# Altium schematic sheet ENET.SchDoc: Ethernet
size A3; Author: Vi Tín; SheetNumber: 12; SheetTotal: 15
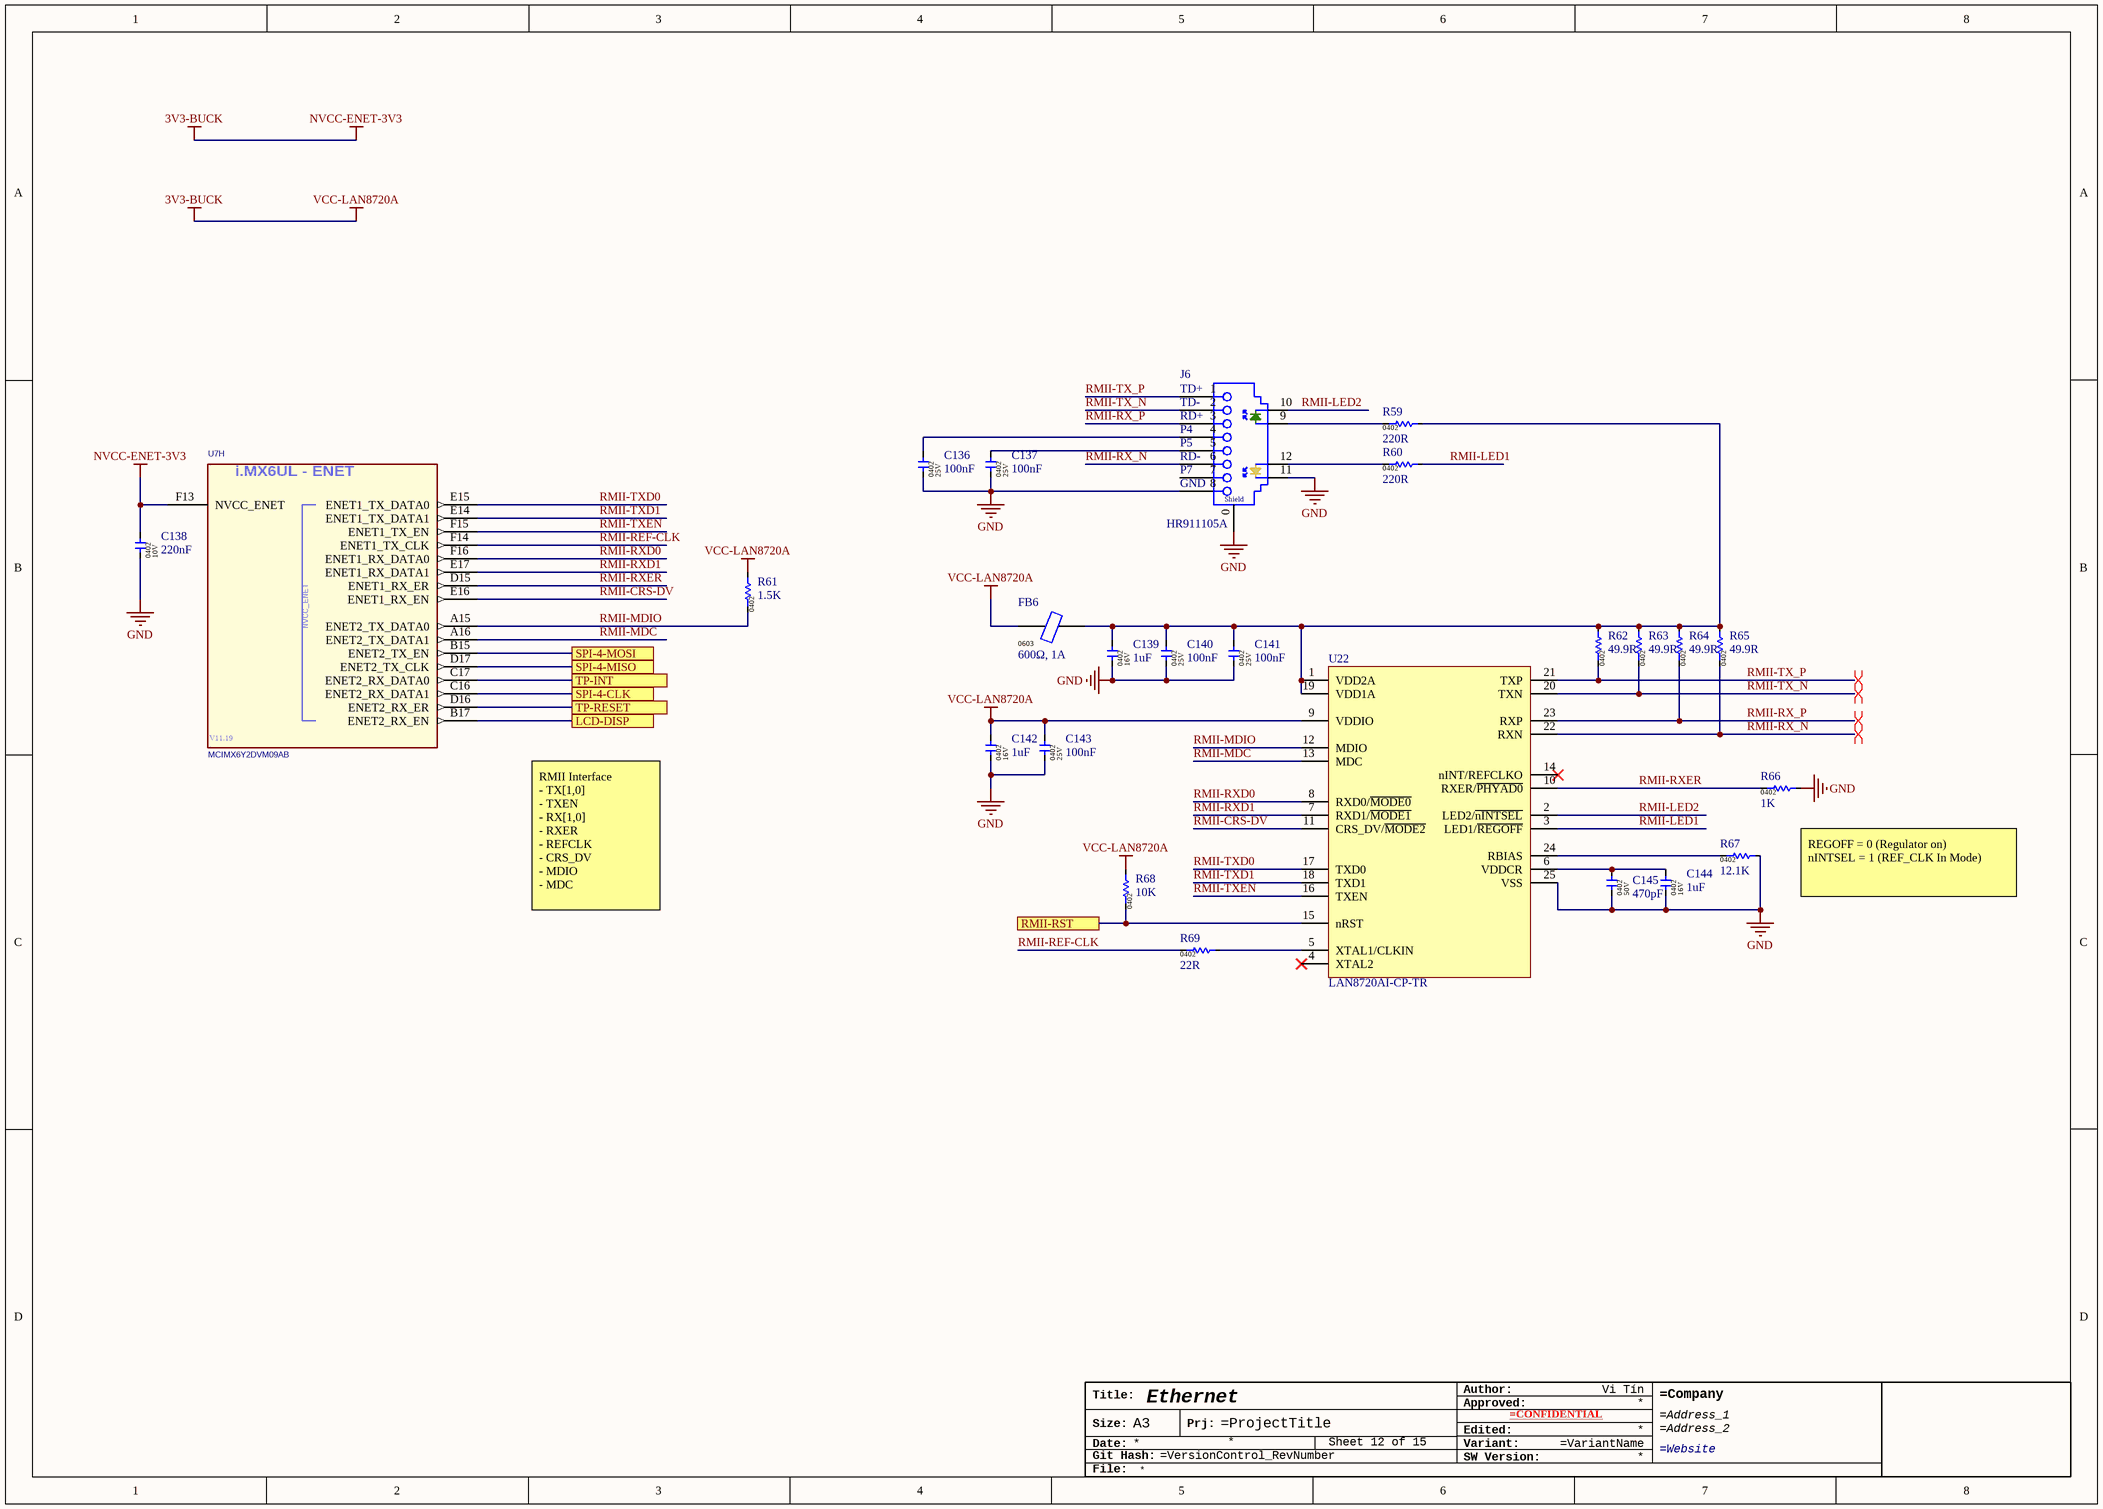
[diagram p0: ENET.SchDoc]

## Parts
*?  TitleBlock_Generic  (value not drawn)  (graphical)
C136  100nF  [CAP-0402]
C137  100nF  [CAP-0402]
C138  220nF  [CAP-0402]
C139  1uF  [CAP-0402]
C140  100nF  [CAP-0402]
C141  100nF  [CAP-0402]
C142  1uF  [CAP-0402]
C143  100nF  [CAP-0402]
C144  1uF  [CAP-0402]
C145  470pF  [CAP-0402]
FB6  600Ω, 1A  [Ferrite-0603]
J6  HR911105A  [RJ-45, Magnetic]
R59  220R  [RES-0402]
R60  220R  [RES-0402]
R61  1.5K  [RES-0402]
R62  49.9R  [RES-0402]
R63  49.9R  [RES-0402]
R64  49.9R  [RES-0402]
R65  49.9R  [RES-0402]
R66  1K  [RES-0402]
R67  12.1K  [RES-0402]
R68  10K  [RES-0402]
R69  22R  [RES-0402]
U7  MCIMX6Y2DVM09AB  [IMX6ULL]  (part H of 11)
U22  LAN8720AI-CP-TR  [QFN24-4x4MM_PAD]

## Ports
LCD-DISP, RMII-RST, SPI-4-CLK, SPI-4-MISO, SPI-4-MOSI, TP-INT, TP-RESET

## Nets
3V3-BUCK: C138.2 C142.2 C143.2 FB6.1 R61.2 R68.2 U7.F13(NVCC_ENET) U22.9(VDDIO)  [also labelled NVCC-ENET-3V3, VCC-LAN8720A]
GND: C136.1 C137.1 C138.1 C139.1 C140.1 C141.1 C142.1 C143.1 C144.1 C145.1 J6.0(GND) J6.8(GND) J6.11 R66.2 R67.2 U22.25(VSS)
LCD-DISP: U7.B17(ENET2_RX_EN) ; port LCD-DISP
RMII-CRS-DV: U7.E16(ENET1_RX_EN) U22.11(CRS_DV/~{MODE2})
RMII-LED1: R60.2 U22.3(LED1/~{REGOFF})
RMII-LED2: J6.10 U22.2(LED2/~{nINTSEL})
RMII-MDC: U7.A16(ENET2_TX_DATA1) U22.13(MDC)
RMII-MDIO: R61.1 U7.A15(ENET2_TX_DATA0) U22.12(MDIO)
RMII-REF-CLK: R69.1 U7.F14(ENET1_TX_CLK)
RMII-RST: R68.1 U22.15(nRST) ; port RMII-RST
RMII-RX_N: J6.6(RCT) R65.1 U22.22(RXN)
RMII-RX_P: J6.3(TD-) R64.1 U22.23(RXP)
RMII-RXD0: U7.F16(ENET1_RX_DATA0) U22.8(RXD0/~{MODE0})
RMII-RXD1: U7.E17(ENET1_RX_DATA1) U22.7(RXD1/~{MODE1})
RMII-RXER: R66.1 U7.D15(ENET1_RX_ER) U22.10(RXER/~{PHYAD0})
RMII-TX_N: J6.2(TCT) R63.1 U22.20(TXN)
RMII-TX_P: J6.1(TD+) R62.1 U22.21(TXP)
RMII-TXD0: U7.E15(ENET1_TX_DATA0) U22.17(TXD0)
RMII-TXD1: U7.E14(ENET1_TX_DATA1) U22.18(TXD1)
RMII-TXEN: U7.F15(ENET1_TX_EN) U22.16(TXEN)
SPI-4-CLK: U7.C16(ENET2_RX_DATA1) ; port SPI-4-CLK
SPI-4-MISO: U7.D17(ENET2_TX_CLK) ; port SPI-4-MISO
SPI-4-MOSI: U7.B15(ENET2_TX_EN) ; port SPI-4-MOSI
TP-INT: U7.C17(ENET2_RX_DATA0) ; port TP-INT
TP-RESET: U7.D16(ENET2_RX_ER) ; port TP-RESET
NetC136_2: C136.2 J6.4(P4)
NetC137_2: C137.2 J6.5(RD+)
NetC139_2: C139.2 C140.2 C141.2 FB6.2 R59.2 R62.2 R63.2 R64.2 R65.2 U22.1(VDD2A) U22.19(VDD1A)
NetC144_2: C144.2 C145.2 U22.6(VDDCR)
NetJ6_9: J6.9 R59.1
NetJ6_12: J6.12 R60.1
NetR67_1: R67.1 U22.24(RBIAS)
NetR69_2: R69.2 U22.5(XTAL1/CLKIN)

Not connected (* = marked no-connect by the designer): J6 7(RD-); U22 4(XTAL2)* 14(nINT/REFCLKO)*

## Layout directives
differential pair; differential pair class DIFF100_ENET: RMII-RX_N, RMII-RX_P, RMII-TX_N, RMII-TX_P

## Notes on the sheet
- RMII Interface
  - TX[1,0]
  - TXEN
  - RX[1,0]
  - RXER
  - REFCLK
  - CRS_DV
  - MDIO
  - MDC
- REGOFF = 0 (Regulator on)
  nINTSEL = 1 (REF_CLK In Mode)
- (in symbol HR911105A) P5; P7; Shield
- (in symbol MCIMX6Y2DVM09AB, part H) i.MX6UL - ENET; V11.19
- (in symbol TitleBlock_Generic) Author:; Title:; Approved:; Size:; A3; Prj:; Edited:; Date:; Variant:; SW Version:; Git Hash:; File:

## Library data of the parts
C136 C137 C140 C141 C143 = 0402X104K250CT: 100nF ±10% 25V X5R 0402 Multilayer Ceramic Capacitors MLCC - SMD/SMT RoHS; Manufacture: WALSIN; Package / Case: 0402; Component type: Capacitor; Manufacture part: 0402X104K250CT; Capacitor value: 100nF; Voltage: 25V; Package: 0402
C138 = 0402X224J100CT: 220nF ±5% 10V X5R 0402 Multilayer Ceramic Capacitors MLCC - SMD/SMT RoHS; Manufacture: WALSIN; Package / Case: 0402; Component type: Capacitor; Manufacture part: 0402X224J100CT; Capacitor value: 220nF; Voltage: 10V; Package: 0402
C139 C142 C144 = 0402X105K160CT: 1uF ±10% 16V X5R 0402 Multilayer Ceramic Capacitors MLCC - SMD/SMT RoHS; Manufacture: WALSIN; Package / Case: 0402; Component type: Capacitor; Manufacture part: 0402X105K160CT; Capacitor value: 1uF; Voltage: 16V; Package: 0402
C145 = 0402B471K500CT: 50V 470pF X7R ±10% 0402 Multilayer Ceramic Capacitors MLCC - SMD/SMT ROHS; Manufacture: WALSIN; Package / Case: 0402; Component type: Capacitor; Manufacture part: 0402B471K500CT; Capacitor value: 470pF; Voltage: 50V; Package: 0402
FB6 = UPZ1608E601-1R0TF: 600Ω @ 100MHz 1A 1 150mΩ 0603 Ferrite Beads RoHS; Manufacture: SUNLORD; Manufacture part: UPZ1608E601-1R0TF; Package: 0603; Value: 600Ω, 1A
J6 = HR911105A: RJ45 12 1 Green - Yellow Through Hole Ethernet Connectors/Modular Connectors (RJ45 RJ11) RoHS; Manufacture: HANRUN; Manufacture part: HR911105A; Type: RJ45-Magnetic; Datasheet: https://datasheet.lcsc.com/lcsc/1811141815_HANRUN-Zhongshan-HanRun-Elec-HR911105A_C12074.pdf
R59 R60 = WR04X2200FTL: 220Ω ±1% 1/16W ±100ppm/℃ 0402 Chip Resistor - Surface Mount RoHS; Manufacture: WALSIN; Package / Case: 0201; Component type: Resistor; Manufacture part: WR04X2200FTL; Resistor value: 220R; Package: 0402
R61 = WR04X1501FTL: ±1% 1/16W 50V ±100ppm/℃ -55℃~+155℃ 1.5kΩ 0402 Chip Resistor - Surface Mount ROHS; Manufacture: WALSIN; Package / Case: 0201; Component type: Resistor; Manufacture part: WR04X1501FTL; Resistor value: 1.5K; Package: 0402
R62-R65 = WR04X49R9FTL: ±1% 1/16W ±100ppm/℃ 49.9Ω 0402 Chip Resistor - Surface Mount ROHS; Manufacture: WALSIN; Package / Case: 0201; Component type: Resistor; Manufacture part: WR04X49R9FTL; Resistor value: 49.9R; Package: 0402
R66 = WR04X1001FTL: 1kΩ ±1% 1/16W ±100ppm/℃ 0402 Chip Resistor - Surface Mount RoHS; Manufacture: WALSIN; Package / Case: 0201; Component type: Resistor; Manufacture part: WR04X1001FTL; Resistor value: 1K; Package: 0402
R67 = WR04X1212FTL: ±1% 1/16W 50V ±100ppm/℃ -55℃~+155℃ 12.1kΩ 0402 Chip Resistor - Surface Mount ROHS; Manufacture: WALSIN; Package / Case: 0201; Component type: Resistor; Manufacture part: WR04X1212FTL; Resistor value: 12.1K; Package: 0402
R68 = WR04X1002FTL: 10kΩ ±1% 1/16W ±100ppm/℃ 0402 Chip Resistor - Surface Mount RoHS; Manufacture: WALSIN; Package / Case: 0201; Component type: Resistor; Manufacture part: WR04X1002FTL; Resistor value: 10K; Package: 0402
R69 = WR04X22R0FTL: 22Ω ±1% 1/16W ±100ppm/℃ 0402 Chip Resistor - Surface Mount RoHS; Manufacture: WALSIN; Package / Case: 0201; Component type: Resistor; Manufacture part: WR04X22R0FTL; Resistor value: 22R; Package: 0402
U7 = MCIMX6Y2DVM09AB: Microprocessors - MPU i.MX 32-bit MPU ARM -A7 900MHz, 0.8mm Pitch; Manufacture: NXP Semiconductors; CLASS: IC; CAD_APPROVED: Yes; PRE_APN: 330-76997; MFG_PN01: PCIMX6G3CVM05AA; MFG_NAME01: FREESCALE SEMICONDUCTOR; AGILE_PN: TMP-WF-23753; HEIGHT: 1.37 MM; ROHS: Yes; Manufacture part: MCIMX6Y2DVM09AB; Package: MAPBGA-289 (14x14); Datasheet: https://www.mouser.vn/datasheet/2/302/IMX6ULLCEC-1126331.pdf
U22 = LAN8720AI-CP-TR: Ethernet Transceivers 10/100 Base-T/TX PHY RMII 1.6V ~ 3.6V QFN-24_4x4x05P Ethernet ICs RoHS; Manufacture: Microchip Tech; Manufacture part: LAN8720AI-CP-TR; Package: QFN-24 (4x4); Datasheet: https://datasheet.lcsc.com/lcsc/1809291909_Microchip-Tech-LAN8720AI-CP-TR_C17146.pdf
*? = TitleBlock_Generic: Manufacture part: TitleBlock_Generic; Manufacture: N/A; Type: Graphic